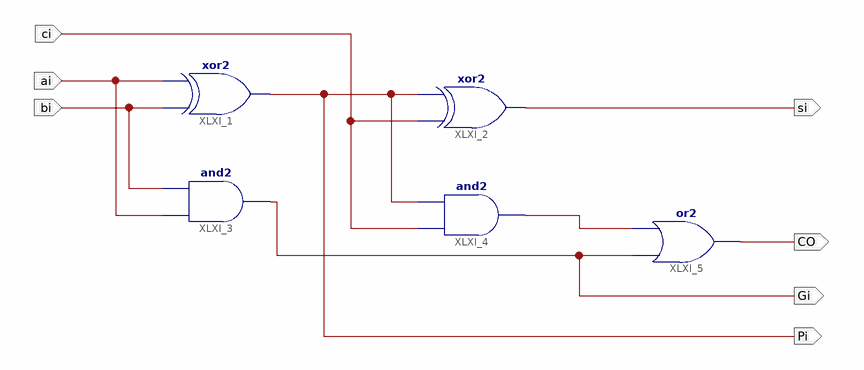
[diagram p0: schematic sheet 1]
// Xilinx ISE schematic add.sch (kintex7) as structural Verilog: 5 symbols, 7 ports
module add (
  input  ai,
  input  bi,
  input  ci,
  output si,
  output CO,
  output Gi,
  output Pi
);

  wire XLXN_9;

  xor XLXI_1 (Pi, bi, ai);
  xor XLXI_2 (si, ci, Pi);
  and XLXI_3 (Gi, ai, bi);
  and XLXI_4 (XLXN_9, ci, Pi);
  or XLXI_5 (CO, Gi, XLXN_9);
endmodule
